# EAGLE schematic BigButton (EAGLE 6.5.0)
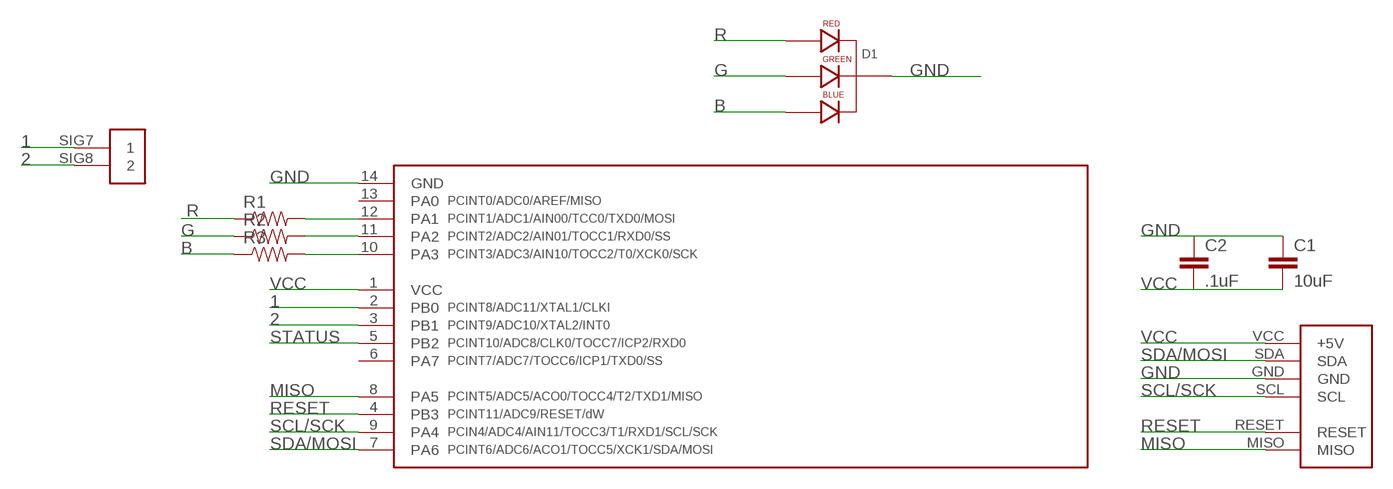
[diagram p0: schematic, sheet 1]

## Parts
C1  10uF  CAP0805  [0805]
C2  .1uF  CAP0805  [0805]
D1  LED-RGB-CC-THRUCLEAR  [LED-RGB-THRU]
R1  RESISTOR0805-RES  [0805]
R2  RESISTOR0805-RES  [0805]
R3  RESISTOR0805-RES  [0805]
U$1  BUTTONPAD  [BUTTONPAD]
U$3  TINY841  [SOIC14]
U$4  FOOTPRINTFOOTPRINT-2  [FOOTPRINT2]

## Nets
1: U$1.SIG7 U$3.2(PB0)
2: U$1.SIG8 U$3.3(PB1)
B: D1.4(BLUE_CATHODE) R3.1
G: D1.3(GREEN_CATHODE) R2.1
GND: C1.1 C2.1 D1.2(CATHODE) U$3.14(GND) U$4.GND
MISO: U$3.8(PA5) U$4.MISO
N$1: R1.2 U$3.12(PA1)
N$2: R2.2 U$3.11(PA2)
N$3: R3.2 U$3.10(PA3)
R: D1.1(RED_CATHODE) R1.1
RESET: U$3.4(PB3) U$4.RESET
SCL/SCK: U$3.9(PA4) U$4.SCL
SDA/MOSI: U$3.7(PA6) U$4.SDA
STATUS: U$3.5(PB2)
VCC: C1.2 C2.2 U$3.1(VCC) U$4.VCC(+5V)
Unconnected: U$3.6(PA7) U$3.13(PA0)

## Library data of the parts
C1 C2 = SparkFun-Capacitors:CAP: Capacitor Standard 0603 ceramic capacitor, and 0.1" leaded capacitor.
D1 = SparkFun-LED:LED-RGB-CC-THRU: RGB Through-hole common cathode LED SparkFun Storefront: COM-00105 (Clear) COM-09264 (Diffuse); PROD_ID: DIO-08418
R1-R3 = SparkFun-Resistors:RESISTOR: Resistor Basic schematic elements and footprints for 0603, 1206, and PTH resistors.
U$1 = IntegerLabs:BUTTONPAD
U$3 = IntegerLabs:TINY841
U$4 = IntegerLabs:FOOTPRINT